# Altium schematic sheet main.SchDoc
size A4
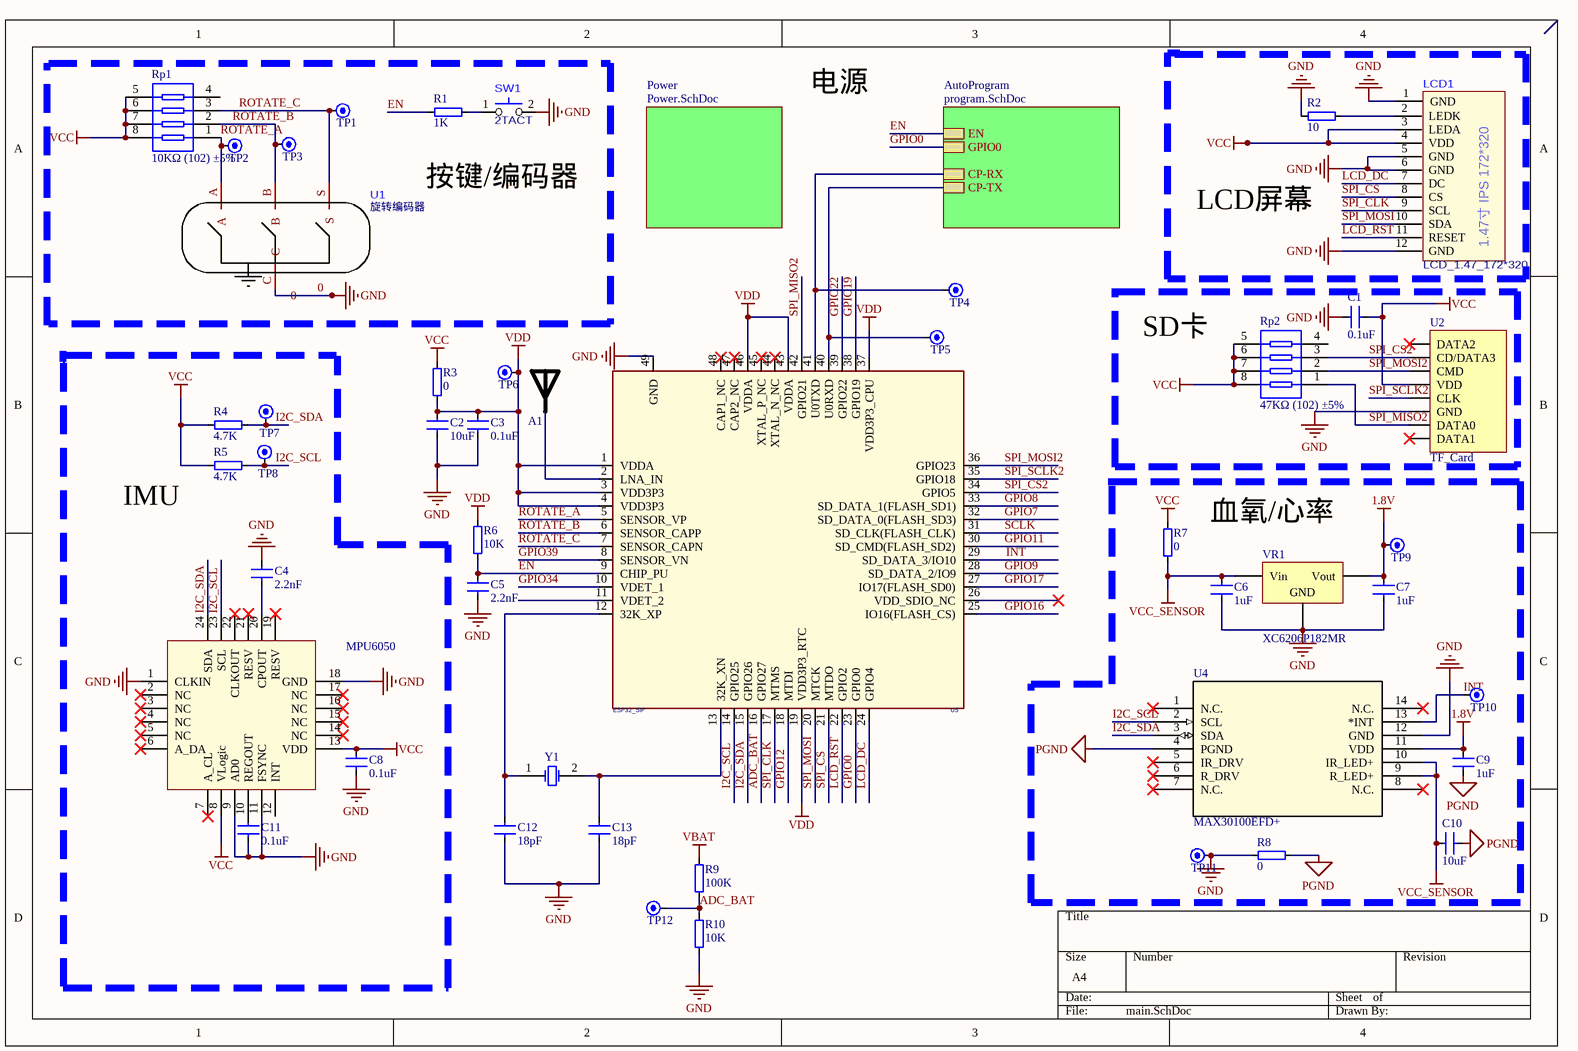
[diagram p0: main.SchDoc]

## Parts
A1  RAINSUN  [ANT-Rainsun-AN5120]  (value not drawn)
C1  0.1uF  [C0402]
C2  10uF  [C0402]
C3  0.1uF  [C0402]
C4  2.2nF  [C0402]
C5  2.2nF  [C0402]
C6  1uF  [C0402]
C7  1uF  [C0402]
C8  0.1uF  [C0402]
C9  1uF  [C0402]
C10  10uF  [C0402]
C11  0.1uF  [C0402]
C12  18pF  [C0402]
C13  18pF  [C0402]
LCD1  LCD_1.47_172*320  [LCD_1.47_172*320_TOP]
R1  1K  [R0402]
R2  10  [R0402]
R3  0  [R0402]
R4  4.7K  [R0402]
R5  4.7K  [R0402]
R6  10K  [R0402]
R7  0  [R0402]
R8  0  [R0402]
R9  100K  [R0402]
R10  10K  [R0402]
Rp1  10KΩ (102) ±5%  [0402_Rx4]
Rp2  47KΩ (102) ±5%  [0402_Rx4]
SW1  2TACT  [SW-SMD_L3.9-W2.9-LS4.8-EH-A]
TP1  TP  [Test-Point]  (value not drawn)
TP2  TP  [Test-Point]  (value not drawn)
TP3  TP  [Test-Point]  (value not drawn)
TP4  TP  [Test-Point]  (value not drawn)
TP5  TP  [Test-Point]  (value not drawn)
TP6  TP  [Test-Point]  (value not drawn)
TP7  TP  [Test-Point]  (value not drawn)
TP8  TP  [Test-Point]  (value not drawn)
TP9  TP  [Test-Point]  (value not drawn)
TP10  TP  [Test-Point]  (value not drawn)
TP11  TP  [Test-Point]  (value not drawn)
TP12  TP  [Test-Point]  (value not drawn)
U1  旋转编码器  [SW-SMD_SIQ-02FVS3_1]
U2  TF_Card  [TF_CARD_MINI]
U3  MPU6050  [QFN-24]
U4  MAX30100EFD+  [21-0880B_MXM]
U5  ESP32_SIP  [QFN-48_7X7]
VR1  XC6206P182MR  [SOT-23-3L]
Y1  32.768KHz ±20ppm 12.5pF  [SMD-3215_2P FC - 135]  (value not drawn)

## Sub-sheets
AutoProgram = program.SchDoc: EN, GPIO0, CP-RX, CP-TX
Power = Power.SchDoc: no entries

## Nets
1.8V: C7.1 C9.1 TP9.1(Test_Point) U4.11(VDD) VR1.2(Vout)
GND: C1.2 C2.2 C3.2 C4.1 C5.2 C6.2 C7.2 C8.2 C11.2 C12.2 C13.2 LCD1.1(GND) LCD1.5(GND) LCD1.6(GND) LCD1.12(GND) R2.1 R8.2 R10.2 SW1.2 TP11.1(Test_Point) U1.0 U1.C U2.6(GND) U3.1(CLKIN) U3.9(AD0) U3.11(FSYNC) U3.18(GND) U4.12(GND) U5.49(GND) VR1.1(GND)
PGND: C9.2 C10.1 R8.1 U4.4(PGND)
VBAT: R9.1
VCC: C1.1 C8.1 LCD1.3(LEDA) LCD1.4(VDD) R3.2 R4.2 R5.2 R7.2 Rp1.5 Rp1.6 Rp1.7 Rp1.8 Rp2.5 Rp2.6 Rp2.7 Rp2.8 U2.4(VDD) U3.8(VLogic) U3.13(VDD)
VCC_SENSOR: C6.1 C10.2 R7.1 U4.9(R_LED+) U4.10(IR_LED+) VR1.3(Vin)
VDD: C2.1 C3.1 R3.1 R6.2 TP6.1(Test_Point) U5.1(VDDA) U5.3(VDD3P3) U5.4(VDD3P3) U5.19(VDD3P3_RTC) U5.37(VDD3P3_CPU) U5.43(VDDA) U5.46(VDDA)
ADC_BAT: R9.2 R10.1 TP12.1(Test_Point) U5.16(GPIO27)
EN: C5.1 R1.2 R6.1 U5.9(CHIP_PU) ; sheet AutoProgram/EN
GPIO0: U5.23(GPIO0) ; sheet AutoProgram/GPIO0
GPIO7: U5.32(SD_DATA_0(FLASH_SD3))
GPIO8: U5.33(SD_DATA_1(FLASH_SD1))
GPIO9: U5.28(SD_DATA_2/IO9)
GPIO11: U5.30(SD_CMD(FLASH_SD2))
GPIO12: U5.18(MTDI)
GPIO16: U5.25(IO16(FLASH_CS))
GPIO17: U5.27(IO17(FLASH_SD0))
GPIO19: U5.38(GPIO19)
GPIO22: U5.39(GPIO22)
GPIO34: U5.10(VDET_1)
GPIO39: U5.8(SENSOR_VN)
I2C_SCL: R5.1 TP8.1(Test_Point) U3.23(SCL) U4.2(SCL) U5.14(GPIO25)
I2C_SDA: R4.1 TP7.1(Test_Point) U3.24(SDA) U4.3(SDA) U5.15(GPIO26)
INT: TP10.1(Test_Point) U4.13(*INT) U5.29(SD_DATA_3/IO10)
LCD_DC: LCD1.7(DC) U5.24(GPIO4)
LCD_RST: LCD1.11(RESET) U5.22(GPIO2)
ROTATE_A: Rp1.1 TP2.1(Test_Point) U1.A U5.5(SENSOR_VP)
ROTATE_B: Rp1.2 TP3.1(Test_Point) U1.B U5.6(SENSOR_CAPP)
ROTATE_C: Rp1.3 TP1.1(Test_Point) U1.S U5.7(SENSOR_CAPN)
SCLK: U5.31(SD_CLK(FLASH_CLK))
SPI_CLK: LCD1.9(SCL) U5.17(MTMS)
SPI_CS: LCD1.8(CS) U5.21(MTDO)
SPI_CS2: Rp2.3 U2.2(CD/DATA3) U5.34(GPIO5)
SPI_MISO2: Rp2.1 U2.7(DATA0) U5.42(GPIO21)
SPI_MOSI: LCD1.10(SDA) U5.20(MTCK)
SPI_MOSI2: Rp2.2 U2.3(CMD) U5.36(GPIO23)
SPI_SCLK2: U2.5(CLK) U5.35(GPIO18)
NetA1_1: A1.1 U5.2(LNA_IN)
NetC4_2: C4.2 U3.20(CPOUT)
NetC11_1: C11.1 U3.10(REGOUT)
NetC12_1: C12.1 U5.12(32K_XP) Y1.1(OSC1)
NetC13_1: C13.1 U5.13(32K_XN) Y1.2(OSC2)
NetLCD1_2: LCD1.2(LEDK) R2.2
NetR1_1: R1.1 SW1.1
NetTP4_1: TP4.1(Test_Point) U5.41(U0TXD) ; sheet AutoProgram/CP-RX
NetTP5_1: TP5.1(Test_Point) U5.40(U0RXD) ; sheet AutoProgram/CP-TX

Not connected (* = marked no-connect by the designer): Rp1 4; Rp2 4; U2 1(DATA2)* 8(DATA1)*; U3 2(NC)* 3(NC)* 4(NC)* 5(NC)* 6(A_DA)* 7(A_CL)* 12(INT) 14(NC)* 15(NC)* 16(NC)* 17(NC)* 19(RESV)* 21(RESV)* 22(CLKOUT)*; U4 1(N.C.)* 5(IR_DRV)* 6(R_DRV)* 7(N.C.)* 8(N.C.)* 14(N.C.)*; U5 11(VDET_2) 26(VDD_SDIO_NC)* 44(XTAL_N_NC)* 45(XTAL_P_NC)* 47(CAP2_NC)* 48(CAP1_NC)*

## Notes on the sheet
- 电源
- 按键/编码器
- LCD屏幕
- SD卡
- IMU
- 血氧/心率
- (in symbol LCD_1.47_172*320) 1.47寸 IPS 172*320

## Library data of the parts
A1 = ANT-Rainsun-AP5120
C1-C13 = CAP
R1-R10 = RES: PAKING: 0603; Precision: 5%
Rp1 Rp2 = 0402*4 1KΩ (102) 5%: 贴片排阻; ComponentLink1Description: 供应商链接; ComponentLink1URL: http://www.szlcsc.com/product/details_26469.html; Package: 0402*4; Supplier: LC; SuppliersPartNumber: C25726
SW1 = YD-3410
U1 = SIQ-02FVS3_1
U3 = MPU6050: 六轴传感器
U4 = MAX30100EFD+: No Description Available; Mfr_Name: Maxim Integrated Products; Copyright: Copyright (C) 2022 Ultra Librarian. All rights reserved.; Manufacturer_Part_Number: MAX30100EFD+; RefDes: RefDes; Type: DEV
U5 = ESP32-PICO
VR1 = SOT-23 XC6206P332MR: 低压差线性稳压(LDO); ComponentLink1Description: 供应商链接; ComponentLink1URL: http://www.szlcsc.com/product/details_5896.html; Package: SOT-23; Supplier: LC; SuppliersPartNumber: C5446
Y1 = SMD-3215_2P 32.768KHz 20ppm 12.5pF: 贴片晶振; ComponentLink1Description: 供应商链接; ComponentLink1URL: http://www.szlcsc.com/product/details_33310.html; Package: SMD-3215_2P; Supplier: LC; SuppliersPartNumber: C32346